# EAGLE design airttenuator (EAGLE 9.6.0)
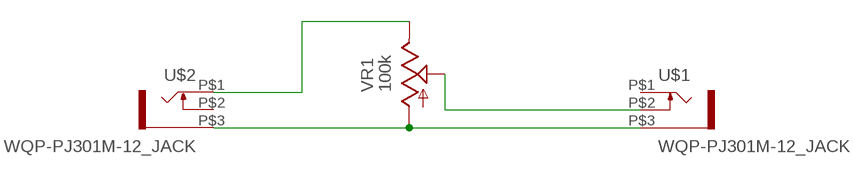
[diagram p0: schematic, sheet 1]

## Parts
U$1  WQP-PJ301M-12_JACK  [WQP-PJ301M-12_JACK]
U$2  WQP-PJ301M-12_JACK  [WQP-PJ301M-12_JACK]
VR1  100k  9MM_SNAP-IN_POT_  [9MM_SNAP-IN_POT]

## Nets
N$1: U$1.P$3 U$2.P$3 VR1.1(A)
N$2: U$2.P$1 VR1.3(E)
N$3: U$1.P$2 VR1.2(S)
Unconnected: U$1.P$1 U$2.P$2

## Library data of the parts
U$1 U$2 = connectors:WQP-PJ301M-12_JACK
VR1 = controls:9MM_SNAP-IN_POT: 9mm vertical snap-in pot, Alpha / Panasonic style

## Board
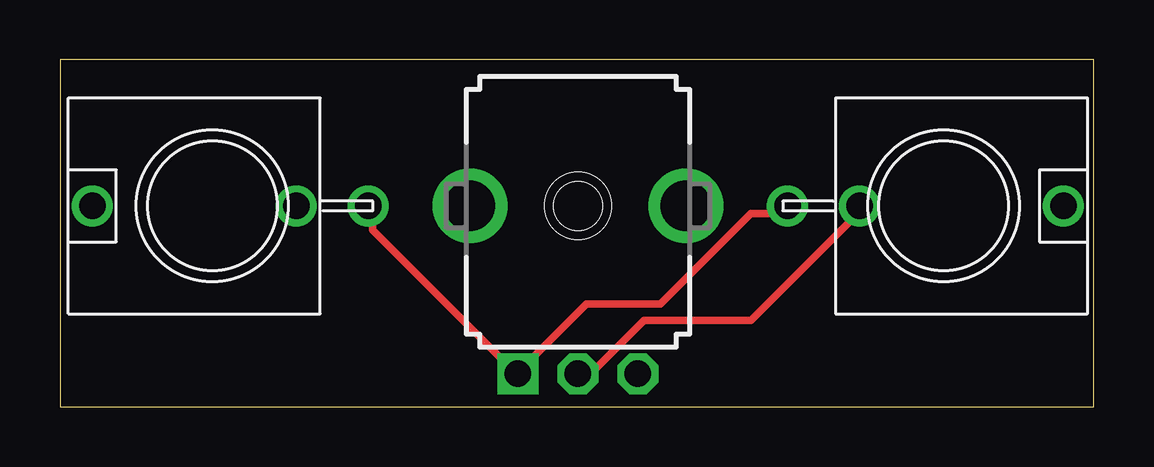
[diagram p1: board, top side]
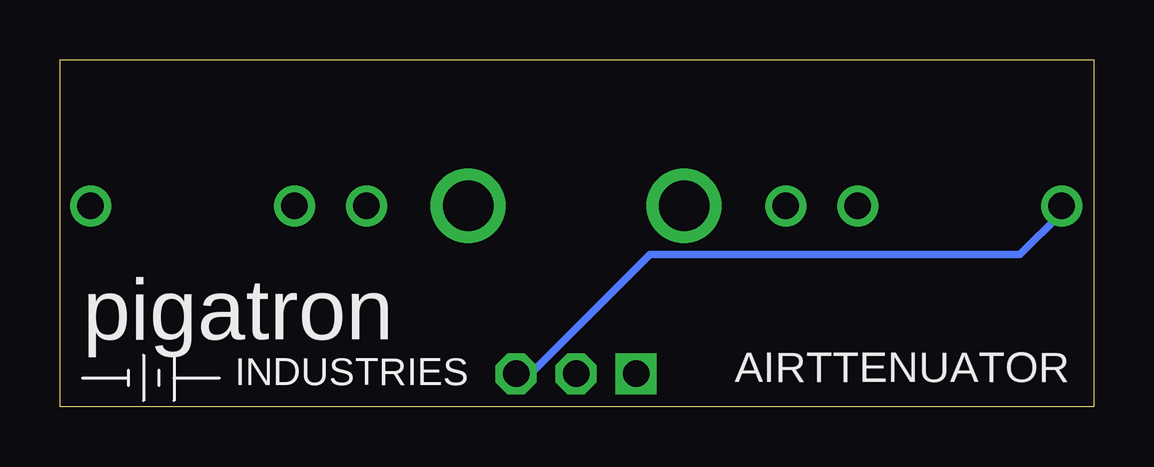
[diagram p2: board, bottom side, seen from below]

Size 43.1 x 14.47 mm. Coordinates in mm from the lower left corner, seen from the top.
Outline: 0,0 43.1,0 43.1,14.47 0,14.47 0,0
Copper layers (1*16): Top 0.0356mm / dielectric 1.5011mm / Bottom 0.0356mm
Design rules "pigatron": minimum track width 12mil, minimum drill 13mil, track to track 15mil, track to pad 10mil, pad to pad 10mil, via to via 10mil, smd to smd 6mil, copper to edge 15mil, drill to drill 10mil, minimum pad ring 12mil, minimum via ring 10mil, stop-mask expansion 4mil, vias tented up to drill 0mil, thermal gap 10mil

### Footprints (pad centres in the part's own frame; a part is rotated, then mirrored left to right if it is on the bottom)
WQP-PJ301M-12_JACK = drill 1.1: P$1 0,5; P$2 0,-3.5; P$3 0,-6.5
9MM_SNAP-IN_POT = drill 1.1 square: 1 -2.5,-7 | drill 1.1 octagon: 2 0,-7; 3 2.5,-7 | drill 2.1 pad 2.794: CHASSIS1 -4.5,0; CHASSIS2 4.5,0

### Placement (x,y rotation side)
U$1  36.83,8.38 270 top
U$2  6.35,8.38 90 top
U$3  [PIGATRON-LOGO]  33.27,2.79 0 bottom
VR1  21.59,8.38 0 top

### Tracks (layer width: path | path; a pad name or v marks a point on that pad's centre or on a via)
N$1
  Top 0.305: U$2.P$3 13.03,8.06 13.03,7.38 18.86,1.55 VR1.1 19.2,1.55 21.95,4.29 25.03,4.29 28.8,8.06 30.18,8.06 U$1.P$3
N$2
  Bottom 0.305: VR1.3 24,1.55 23.32,1.55 18.52,6.35 3.09,6.35 1.37,8.06 U$2.P$1
N$3
  Top 0.305: VR1.2 21.6,1.55 22.29,1.55 24.35,3.61 28.8,3.61 33.26,8.06 U$1.P$2

### Text on the board
bNames: AIRTTENUATOR